# Altium schematic sheet RFFE-Ver1.SchDoc: EBPM-RFFE - Versão 1 (part 2 of 2)
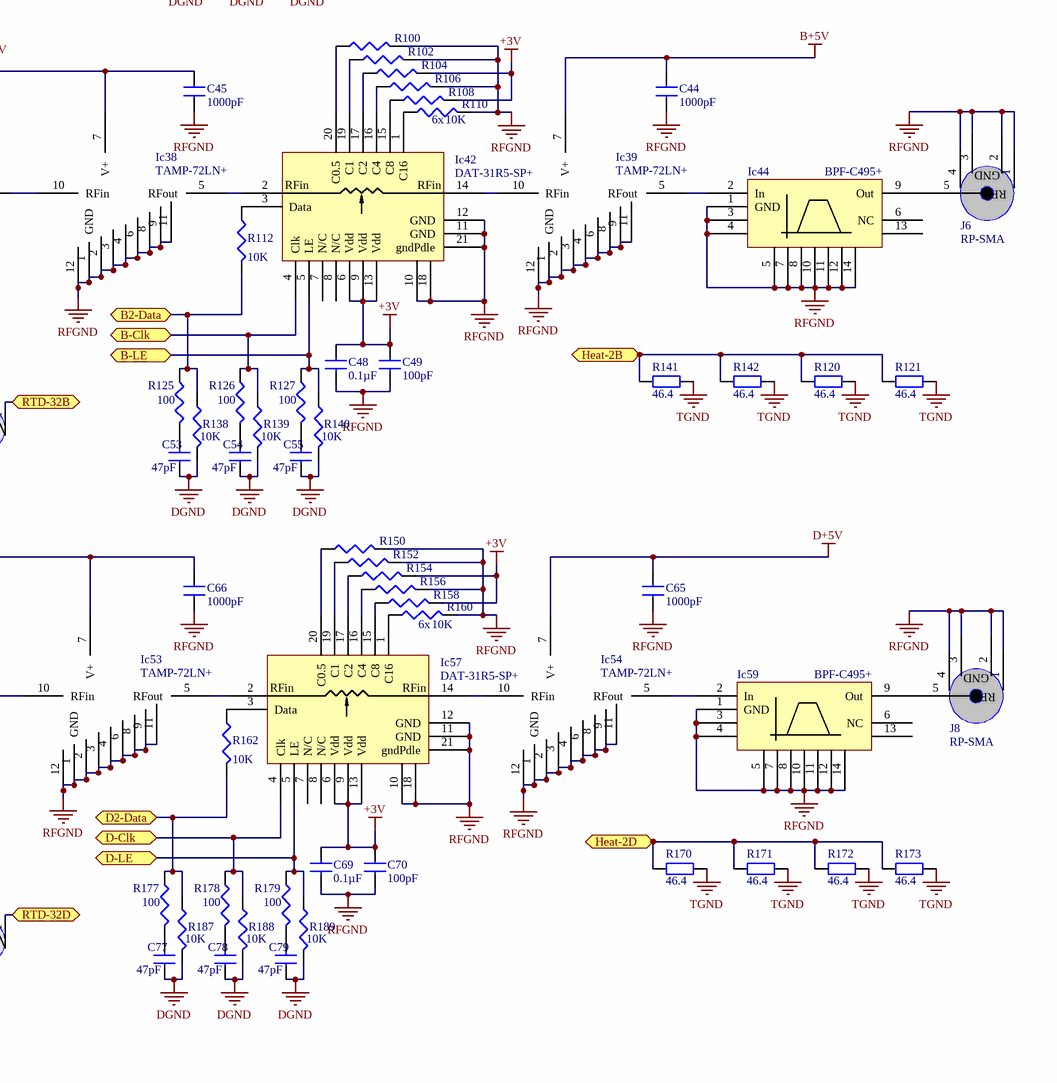
[diagram p3: RFFE-Ver1.SchDoc, bottom right]

## Library data of the parts
C1-C3 C22-C24 C43-C45 C64-C66 = C1608C0G1H102J: CAP CER 1000PF 50V 5% NP0 0603; Manufacturer: TDK Corporation; Temperature Coefficient: C0G, NP0; Supplier 1: Digi-Key; Manufacturer Part Number: C1608C0G1H102J; RoHS: RoHS Compliant; Category: Capacitors; Stock 1: 116011; Pricing 1: 1=0.11, 10=0.078, 100=0.0358, 250=0.02924, 500=0.02502, 1000=0.0195 (USD); Voltage - Rated: 50V; Tolerance: ±5%; Mounting Type: Surface Mount, MLCC; Operating Temperature: -55°C ~ 125°C; Applications: General Purpose; Ratings: -; Package / Case: 0603 (1608 Metric); Size / Dimension: 0.063" L x 0.031" W (1.60mm x 0.80mm); Height - Seated (Max): -; Thickness (Max): 0.037" (0.95mm); Lead Spacing: -; Features: -; Packaging: Cut Tape (CT); Lead Style: -; ComponentLink1URL: http://www.tdk.com/pdf/general_B11.pdf; ComponentLink1Description: http://www.tdk.com/pdf/general_B11.pdf; Supplier Part Number 1: 445-1293-1-ND
C4 C6 C25 C27 C46 C48 C67 C69 = GRM31C5C1E104JA01L: CAP CER 0.1UF 25V 5% NP0 1206; Manufacturer: Murata Electronics North America; Temperature Coefficient: C0G, NP0; Supplier 1: Digi-Key; Manufacturer Part Number: GRM31C5C1E104JA01L; RoHS: RoHS Compliant; Category: Capacitors; Stock 1: 169268; Pricing 1: 1=0.57, 10=0.48, 50=0.3436, 100=0.3007, 250=0.23628, 500=0.2148, 1000=0.17184 (USD); Voltage - Rated: 25V; Tolerance: ±5%; Mounting Type: Surface Mount, MLCC; Operating Temperature: -55°C ~ 125°C; Applications: General Purpose; Ratings: -; Package / Case: 1206 (3216 Metric); Size / Dimension: 0.126" L x 0.063" W (3.20mm x 1.60mm); Height - Seated (Max): -; Thickness (Max): 0.071" (1.80mm); Lead Spacing: -; Features: -; Packaging: Cut Tape (CT); Lead Style: -; ComponentLink1URL: http://search.murata.co.jp/Ceramy/image/img/PDF/ENG/GRM31C5C1E104JA01.pdf; ComponentLink1Description: http://search.murata.co.jp/Ceramy/image/img/PDF/ENG/GRM31C5C1E104JA01.pdf; Supplier Part Number 1: 490-1767-1-ND
C5 C7 C20 C21 C26 C28 C41 C42 C47 C49 C62 C63 C68 C70 C82 C84 = C1608C0G1H101J: CAP CER 100PF 50V 5% NP0 0603; Manufacturer: TDK Corporation; Temperature Coefficient: C0G, NP0; Supplier 1: Digi-Key; Manufacturer Part Number: C1608C0G1H101J; RoHS: RoHS Compliant; Category: Capacitors; Stock 1: 926382; Pricing 1: 1=0.09, 10=0.055, 100=0.0198, 250=0.01432, 500=0.01056, 1000=0.00715 (USD); Voltage - Rated: 50V; Tolerance: ±5%; Mounting Type: Surface Mount, MLCC; Operating Temperature: -55°C ~ 125°C; Applications: General Purpose; Ratings: -; Package / Case: 0603 (1608 Metric); Size / Dimension: 0.063" L x 0.031" W (1.60mm x 0.80mm); Height - Seated (Max): -; Thickness (Max): 0.037" (0.95mm); Lead Spacing: -; Features: -; Packaging: Cut Tape (CT); Lead Style: -; ComponentLink1URL: http://www.tdk.com/pdf/general_B11.pdf; ComponentLink1Description: http://www.tdk.com/pdf/general_B11.pdf; Supplier Part Number 1: 445-1281-1-ND
C8-C17 C29-C38 C50-C59 C72-C81 = C1608C0G1H470J: CAP CER 47PF 50V 5% NP0 0603; Manufacturer: TDK Corporation; Temperature Coefficient: C0G, NP0; Supplier 1: Digi-Key; Manufacturer Part Number: C1608C0G1H470J; RoHS: RoHS Compliant; Category: Capacitors; Stock 1: 109430; Pricing 1: 1=0.1, 10=0.063, 100=0.0225, 250=0.01624, 500=0.012, 1000=0.00813 (USD); Voltage - Rated: 50V; Tolerance: ±5%; Mounting Type: Surface Mount, MLCC; Operating Temperature: -55°C ~ 125°C; Applications: General Purpose; Ratings: -; Package / Case: 0603 (1608 Metric); Size / Dimension: 0.063" L x 0.031" W (1.60mm x 0.80mm); Height - Seated (Max): -; Thickness (Max): 0.037" (0.95mm); Lead Spacing: -; Features: -; Packaging: Cut Tape (CT); Lead Style: -; ComponentLink1URL: http://www.tdk.com/pdf/general_B11.pdf; ComponentLink1Description: http://www.tdk.com/pdf/general_B11.pdf; Supplier Part Number 1: 445-1277-1-ND
C18 C19 C39 C40 C60 C61 C71 C83 = T495B475K016ZTE800: CAP TANT 4.7UF 16V 10% 1411; Manufacturer: Kemet; Manufacturer Size Code: B; ESR (Equivalent Series Resistance): 800.0 mOhm; Type: Molded; Supplier 1: Digi-Key; Manufacturer Part Number: T495B475K016ZTE800; RoHS: RoHS Compliant; Category: Capacitors; Stock 1: 4639; Pricing 1: 1=2.2, 10=1.804, 25=1.628, 100=1.452, 250=1.276, 500=1.188, 1000=0.924 (USD); Voltage - Rated: 16V; Tolerance: ±10%; Operating Temperature: -55°C ~ 125°C; Mounting Type: Surface Mount; Package / Case: 1411 (3528 Metric); Size / Dimension: 0.138" L x 0.110" W (3.50mm x 2.80mm); Height - Seated (Max): 0.083" (2.10mm); Lead Spacing: -; Features: General Purpose; Packaging: Cut Tape (CT); Lifetime @ Temp.: -; ComponentLink1URL: http://www.kemet.com/datasheets&T495B475K016ZTE800; ComponentLink1Description: http://www.kemet.com/datasheets&T495B475K016ZTE800; Supplier Part Number 1: 399-5191-1-ND
Ic1 Ic4 Ic17 Ic19 Ic32 Ic35 Ic47 Ic50 = Minicircuits-HSWA2-30DR+: Absoptive RF Switch SPDT; Manufacturer: Minicircuits; Manufacturer Part Number: HSWA2-30DR+; ComponentLink1Description: http://www.minicircuits.com/pdfs/HSWA2-30DR+.pdf; ComponentLink1URL: http://www.minicircuits.com/pdfs/HSWA2-30DR+.pdf
Ic2 Ic14-Ic16 Ic29-Ic31 Ic33 Ic45 Ic46 Ic48 Ic60-Ic62 = PPG101A1RD: Manufacturer: US Sensor; Resistance (Ohms): 100; Tolerance: ±0.06%; Current: 1mA; Supplier 1: Digi-Key; Manufacturer Part Number: PPG101A1RD; RoHS: RoHS Compliant; Description: DETECTOR RTD TF 100 OHM +/-0.06%; Category: Sensors, Transducers; Stock 1: 2476; Pricing 1: 1=18.5, 10=13.69, 25=11.1, 100=4.07, 250=2.06252 (USD); Packaging: Bulk; Package / Case: Radial; Voltage: -; Temperature: 500°C; Accuracy: -; ComponentLink1URL: http://www.ussensor.com/pdfs/prod_rtds_thin_film.pdf; ComponentLink1Description: http://www.ussensor.com/pdfs/prod_rtds_thin_film.pdf; Supplier Part Number 1: 615-1037-ND
Ic3 Ic18 Ic34 Ic49 = Minicircuits-SBTC-2-10L: Power Splitter 2 way; Manufacturer: Minicircuits; Manufacturer Part Number: SBTC-2-10L+; ComponentLink1Description: http://www.minicircuits.com/pdfs/SBTC-2-10L+.pdf; ComponentLink1URL: *
Ic5 Ic7 Ic8 Ic20 Ic22 Ic23 Ic36 Ic38 Ic39 Ic51 Ic53 Ic54 = Minicircuits-TAMP-72LN+: LNA 20 dB Low Noise Figure; Manufacturer: Minicircuits; Manufacturer Part Number: TAMP-72LN+; ComponentLink1Description: http://www.minicircuits.com/pdfs/TAMP-72LN+.pdf; ComponentLink1URL: http://www.minicircuits.com/pdfs/TAMP-72LN+.pdf
Ic6 Ic11 Ic21 Ic26 Ic37 Ic42 Ic52 Ic57 = Minicircuits-DAT-31R5-SP+: Serial Digital Step Attenuator 31.5 step:0.5dB; Manufacturer: Minicircuits; Manufacturer Part Number: DAT-31R5-SP+; ComponentLink1Description: http://www.minicircuits.com/pdfs/DAT-31R5-SP+.pdf; ComponentLink1URL: http://www.minicircuits.com/pdfs/DAT-31R5-SP+.pdf
Ic9 Ic10 Ic24 Ic25 Ic40 Ic41 Ic55 Ic56 = TST-TA0568A: Band Pass Filter FC475MHz 3dB@12MHz; Manufacturer: Tai-Saw Technology Co; Manufacturer Part Number: TA0568A; ComponentLink1Description: http://www.taisaw.com/upload/product/TA0568A%20_Rev.1.0_.pdf; ComponentLink1URL: http://www.taisaw.com/upload/product/TA0568A%20_Rev.1.0_.pdf
Ic12 Ic27 Ic43 Ic58 = Minicircuits-LFCN-530+: Low Pass Filter 3dB@530MHz; Manufacturer: Minicircuits; Manufacturer Part Number: LFCN-530+; ComponentLink1Description: http://www.minicircuits.com/pdfs/LFCN-530.pdf; ComponentLink1URL: http://www.minicircuits.com/pdfs/LFCN-530.pdf
Ic13 Ic28 Ic44 Ic59 = Minicircuits-BPF-C495+: Band Pass Filter FC495MHz 3dB@50MHz; Description: BPF FC495MHz 3dB@50MHz; Manufacturer: Minicircuits; Manufacturer Part Number: BPF-C495+; ComponentLink1Description: http://www.minicircuits.com/pdfs/BPF-C495+.pdf; ComponentLink1URL: http://www.minicircuits.com/pdfs/BPF-C495+.pdf
J1-J8 = 132289RP: CONN RCPT BLKHD SMA REV POL PCB; Manufacturer: Amphenol Connex; Connector Type: Jack, Male Pins; Contact Termination: Solder; Impedance: 50 Ohm; Frequency - Max: 18GHz; Supplier 1: Digi-Key; Manufacturer Part Number: 132289RP; RoHS: RoHS Compliant; Category: Connectors, Interconnects; Stock 1: 65; Pricing 1: 1=10.8, 10=9.99, 100=8.37, 250=7.29, 500=7.02, 1000=6.75 (USD); Mounting Type: Board Edge, End Launch; Fastening Type: Threaded; Cable Group: -; Features: -; Color: -; Packaging: Bulk; ComponentLink1URL: http://www.amphenolconnex.com/media/downloads/4145/132289rp.pdf; ComponentLink1Description: http://www.amphenolconnex.com/media/downloads/4145/132289rp.pdf; Supplier Part Number 1: ACX1427-ND
R1-R14 R37-R42 R45-R48 R51-R64 R84-R89 R95-R112 R135-R140 R143-R146 R149-R162 R184-R189 R193-R196 = PNM0603E1002BST5: RES 10K OHM .15W 0.1% 0603 SMD; Manufacturer: Vishay Thin Film; Power (Watts): 0.15W; Temperature Coefficient: ±25ppm/°C; Supplier 1: Digi-Key; Manufacturer Part Number: PNM0603E1002BST5; RoHS: RoHS Compliant; Category: Resistors; Stock 1: 780; Pricing 1: 1=3.42, 25=2.85, 100=2.47, 250=2.185 (USD); Composition: Thin Film; Features: Moisture Resistant, Non-Inductive, Non-Magnetic; Tolerance: ±0.1%; Package / Case: 0603 (1608 Metric); Size / Dimension: 0.064" L x 0.032" W (1.63mm x 0.81mm); Height: 0.020" (0.51mm); Number of Terminations: 2; Packaging: Cut Tape (CT); ComponentLink1URL: http://www.vishay.com/docs/60057/pnm.pdf; ComponentLink1Description: http://www.vishay.com/docs/60057/pnm.pdf; Supplier Part Number 1: PNM0603-10KBCT-ND
  R1-R10 R51-R58 R60 R61 R99-R108 R149-R158: Resistance (Ohms): 10K
R15-R17 R25 R26 R34-R36 R43 R44 R49 R50 R68-R70 R72 R73 R90-R94 R115-R117 R120 R121 R132-R134 R141 R142 R147 R148 R167-R173 R190-R192 = CMF5546R400FHEB: RES 46.4 OHM 1% 50PPM 1/2W; Manufacturer: Vishay Dale; Power (Watts): 0.5W, 1/2W; Temperature Coefficient: ±50ppm/°C; Supplier 1: Digi-Key; Manufacturer Part Number: CMF5546R400FHEB; RoHS: RoHS Compliant; Category: Resistors; Stock 1: 5609; Pricing 1: 1=0.17, 10=0.149, 50=0.1386, 100=0.132, 250=0.1188, 500=0.1155 (USD); Composition: Metal Film; Features: Flame Retardant Coating; Tolerance: ±1%; Package / Case: Axial; Size / Dimension: 0.090" Dia x 0.278" L (2.29mm x 7.06mm); Height: -; Number of Terminations: 2; Packaging: Cut Tape (CT); ComponentLink1URL: http://www.vishay.com/doc?31018; ComponentLink1Description: http://www.vishay.com/doc?31018; Supplier Part Number 1: CMF46.4HFCT-ND
R18-R21 R65-R67 R71 R113 R114 R118 R119 R163-R166 = ERJ-3GEY0R00V: RES 0.0 OHM 1/10W 0603 SMD; Manufacturer: Panasonic - ECG; Power (Watts): 0.1W, 1/10W; Tolerance: Jumper; Supplier 1: Digi-Key; RoHS: RoHS Compliant; Category: Resistors; Pricing 1: 1=0.02, 50=0.0092, 100=0.007, 250=0.0052, 500=0.00384, 1000=0.00256 (USD); Composition: Thick Film; Features: -; Temperature Coefficient: -; Package / Case: 0603 (1608 Metric); Size / Dimension: 0.063" L x 0.031" W (1.60mm x 0.80mm); Height: 0.022" (0.55mm); Number of Terminations: 2; Packaging: Cut Tape (CT); ComponentLink1URL: http://industrial.panasonic.com/www-cgi/jvcr13pz.cgi?E+PZ+3+AOA0001+ERJ3GEY0R00V+7+WW; ComponentLink1Description: http://industrial.panasonic.com/www-cgi/jvcr13pz.cgi?E+PZ+3+AOA0001+ERJ3GEY0R00V+7+WW; Supplier Part Number 1: P0.0GCT-ND; Manufacturer Part Number: ERJ-3GEY0R00V
  R18-R21 R65-R67 R113 R114 R118 R119 R163-R166: Stock 1: 12285904
  R71: Stock 1: 12033013
R22-R24 R27-R33 R74-R83 R122-R131 R174-R183 = FC0603E1000BST1: RES 100 OHM 125MW .1% 0603 SMD; Manufacturer: Vishay Thin Film; Power (Watts): 0.125W, 1/8W; Temperature Coefficient: ±25ppm/°C; Tolerance: ±0.1%; Supplier 1: Digi-Key; Manufacturer Part Number: FC0603E1000BST1; RoHS: RoHS Compliant; Category: Resistors; Stock 1: 4404; Pricing 1: 1=2.94, 25=2.2752, 100=2.1, 250=1.96, 500=1.75 (USD); Composition: Thin Film; Features: -; Package / Case: 0603 (1608 Metric); Size / Dimension: 0.064" L x 0.032" W (1.63mm x 0.81mm); Height: 0.015" (0.38mm); Number of Terminations: 2; Packaging: Cut Tape (CT); ComponentLink1URL: http://www.vishay.com/doc?60093; ComponentLink1Description: http://www.vishay.com/doc?60093; Supplier Part Number 1: FC0603-100BWCT-ND